# EAGLE design RC _RX (EAGLE 7.7.0)
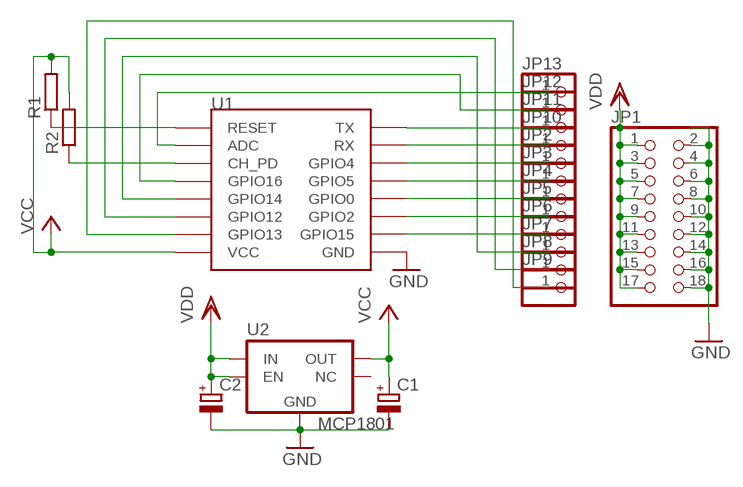
[diagram p0: schematic, sheet 1]

## Parts
C1  CPOL-EUA/3216-18W  [A/3216-18W]
C2  CPOL-EUA/3216-18W  [A/3216-18W]
JP1  PINHD-2X9  [2X09]
JP2  PINHD-1X1  [1X01]
JP3  PINHD-1X1  [1X01]
JP4  PINHD-1X1  [1X01]
JP5  PINHD-1X1  [1X01]
JP6  PINHD-1X1  [1X01]
JP7  PINHD-1X1  [1X01]
JP8  PINHD-1X1  [1X01]
JP9  PINHD-1X1  [1X01]
JP10  PINHD-1X1  [1X01]
JP11  PINHD-1X1  [1X01]
JP12  PINHD-1X1  [1X01]
JP13  PINHD-1X1  [1X01]
R1  R-EU_R0805  [R0805]
R2  R-EU_R0805  [R0805]
U1  ESP12  [ESP12]
U2  MCP1801  [SOT23-5]

## Nets
GND: C1.- C2.- JP1.2 JP1.4 JP1.6 JP1.8 JP1.10 JP1.12 JP1.14 JP1.16 JP1.18 U1.GND U2.2(GND)
N$1: R1.1 U1.RESET
N$2: JP11.1 U1.TX
N$3: JP2.1 U1.GPIO4
N$4: JP3.1 U1.GPIO5
N$5: JP4.1 U1.GPIO0
N$6: JP5.1 U1.GPIO2
N$7: JP6.1 U1.GPIO15
N$8: JP7.1 U1.GPIO14
N$9: JP8.1 U1.GPIO12
N$10: JP9.1 U1.GPIO13
N$11: JP10.1 U1.RX
N$12: R2.1 U1.CH_PD
N$13: JP12.1 U1.GPIO16
N$14: JP13.1 U1.ADC
VCC: C1.+ R1.2 R2.2 U1.VCC U2.5(OUT)
VDD: C2.+ JP1.1 JP1.3 JP1.5 JP1.7 JP1.9 JP1.11 JP1.13 JP1.15 JP1.17 U2.1(IN) U2.3(EN)
Unconnected: U2.4(NC)

## Library data of the parts
C1 C2 = rcl:CPOL-EU: POLARIZED CAPACITOR, European symbol
JP1 = pinhead:PINHD-2X9: PIN HEADER
JP2-JP13 = pinhead:PINHD-1X1: PIN HEADER
R1 R2 = rcl:R-EU_: RESISTOR, European symbol
U1 = esp8266modules:ESP12: ESP8266 Wifi module 12
U2 = bt_regulator:MCP1801: Microchip MCP1801 LDO Regulator The MCP1801 is a family of CMOS low dropout (LDO) voltage regulators that can deliver up to 150 mA of current while consuming only 25 μA of quiescent current (typical) with input operating range from 2.0V to 10.0V. Datasheet.pdf <http://ww1.microchip.com/downloads/en/DeviceDoc/22051D.pdf>

## Board
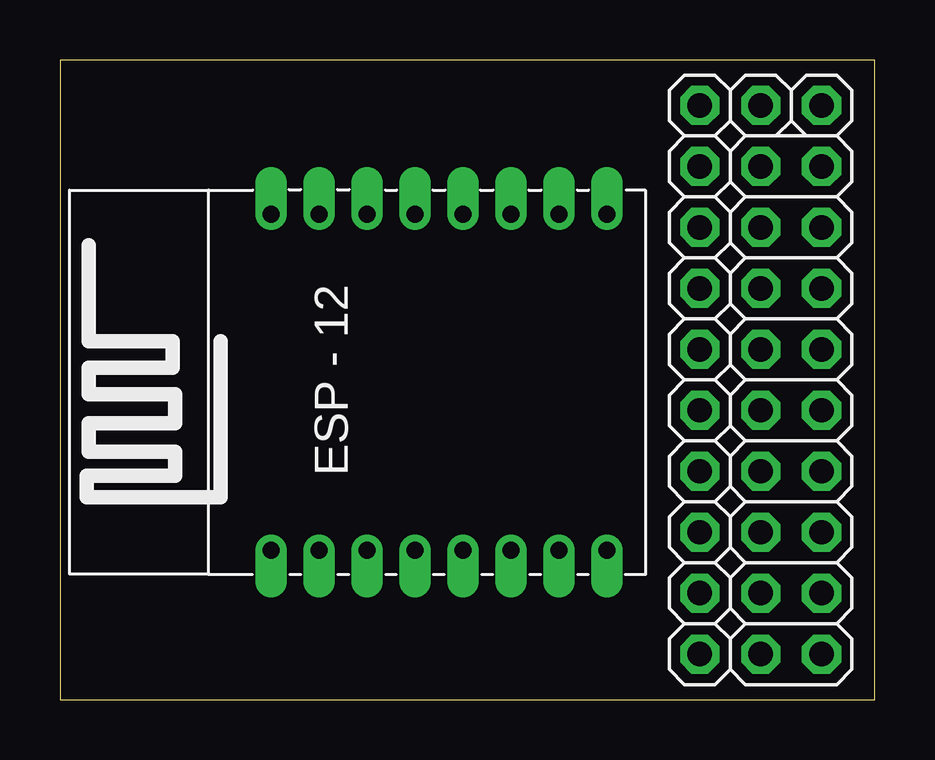
[diagram p1: board, top side]
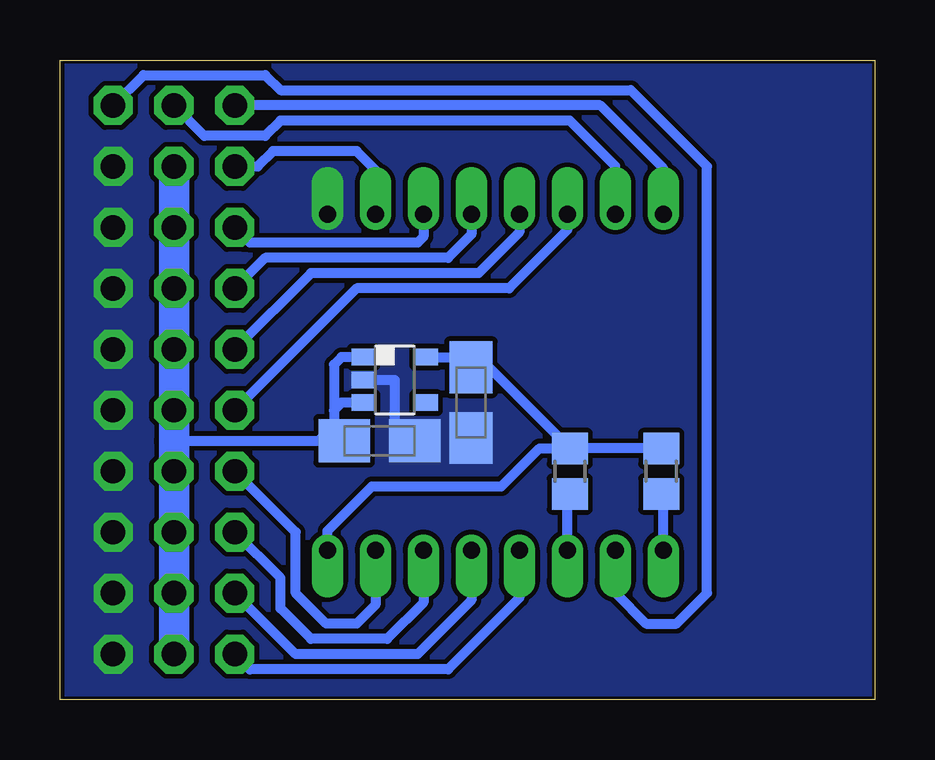
[diagram p2: board, bottom side, seen from below]

Size 33.96 x 26.66 mm. Coordinates in mm from the lower left corner, seen from the top.
Outline: 0,0 33.96,0 33.96,26.66 0,26.66 0,0
Copper layers (1*16): Top 0.035mm / dielectric 1.5mm / Bottom 0.035mm
Design rules "default *": minimum track width 12mil, minimum drill 24mil, track to track 8mil, track to pad 8mil, pad to pad 8mil, via to via 8mil, smd to smd 8mil, copper to edge 5mil, drill to drill 8mil, minimum pad ring 12mil, minimum via ring 12mil, stop-mask expansion 4mil, vias tented up to drill 0mil, thermal gap 10mil

### Footprints (pad centres in the part's own frame; a part is rotated, then mirrored left to right if it is on the bottom)
A/3216-18W = smd 2.15 x 1.8: + 1.475,0; - -1.475,0
2X09 = drill 1.016 octagon: 1 -10.16,-1.27; 2 -10.16,1.27; 3 -7.62,-1.27; 4 -7.62,1.27; 5 -5.08,-1.27; 6 -5.08,1.27; 7 -2.54,-1.27; 8 -2.54,1.27; 9 0,-1.27; 10 0,1.27; 11 2.54,-1.27; 12 2.54,1.27; 13 5.08,-1.27; 14 5.08,1.27; 15 7.62,-1.27; 16 7.62,1.27; 17 10.16,-1.27; 18 10.16,1.27
1X01 = drill 1.016 octagon: 1 0,0
R0805 = smd 1.3 x 1.5: 1 -0.95,0; 2 0.95,0
ESP12 = drill 0.7 offset: ADC -7.1,3.8; CH_PD -7.1,1.8; GND 6.9,-8.2; GPIO0 6.9,-2.2; GPIO2 6.9,-4.2; GPIO4 6.9,1.8; GPIO5 6.9,-0.2; GPIO12 -7.1,-4.2; GPIO13 -7.1,-6.2; GPIO14 -7.1,-2.2; GPIO15 6.9,-6.2; GPIO16 -7.1,-0.2; RESET -7.1,5.8; RX 6.9,3.8; TX 6.9,5.8; VCC -7.1,-8.2
SOT23-5 = smd 0.69 x 0.99: 1 -0.95,-1.3; 2 0,-1.3; 3 0.95,-1.3; 4 0.95,1.3; 5 -0.95,1.3

### Placement (x,y rotation side)
C1  16.83,12.38 90 bottom
C2  20.64,10.79 180 bottom
JP1  30.48,12.06 270 top
JP2  26.67,12.06 0 top
JP3  26.67,14.61 0 top
JP4  26.67,17.14 0 top
JP5  26.67,19.68 0 top
JP6  26.67,22.23 0 top
JP7  26.67,4.45 0 top
JP8  26.67,6.99 0 top
JP9  26.67,9.53 0 top
JP10  29.21,24.77 0 top
JP11  26.67,24.77 0 top
JP12  26.67,1.91 0 top
JP13  31.75,24.77 0 top
R1  8.89,9.53 90 bottom
R2  12.7,9.53 90 bottom
U1  14.61,13.34 90 top
U2  20,13.34 270 bottom

### Tracks (layer width: path | path; a pad name or v marks a point on that pad's centre or on a via)
GND
  Bottom 0.406: U2.2 20,13.34 20,11.63 C2.-
  pour Bottom (no thermals): 0,26.67 33.66,26.67 33.66,0 0,0
N$1
  Bottom 0.406: U1.RESET 8.8,8.49 R1.1
N$2
  Bottom 0.406: U1.TX 8.8,22.14 11.43,24.77 JP11.1
N$3
  Bottom 0.406: U1.GPIO4 12.8,19.58 15.24,17.14 21.59,17.14 JP2.1
N$4
  Bottom 0.406: U1.GPIO5 14.8,19.48 16.51,17.78 23.5,17.78 JP3.1
N$5
  Bottom 0.406: U1.GPIO0 16.8,19.39 17.78,18.41 25.4,18.41 JP4.1
N$6
  Bottom 0.406: U1.GPIO2 18.8,19.3 19.05,19.05 26.04,19.05 JP5.1
N$7
  Bottom 0.406: JP6.1 25.72,22.23 25.09,22.86 21.59,22.86 20.8,22.07 U1.GPIO15
N$8
  Bottom 0.406: U1.GPIO14 16.8,4.15 19.05,1.91 24.13,1.91 JP7.1
N$9
  Bottom 0.406: U1.GPIO12 18.8,4.05 20.32,2.54 23.5,2.54 24.77,3.81 24.77,5.08 JP8.1
N$10
  Bottom 0.406: U1.GPIO13 20.8,3.96 21.59,3.17 22.86,3.17 24.13,4.45 24.13,6.99 JP9.1
N$11
  Bottom 0.406: JP10.1 27.94,23.5 25.4,23.5 24.77,24.13 12.7,24.13 10.8,22.23 U1.RX
N$12
  Bottom 0.406: U1.CH_PD 12.8,8.47 R2.1
N$13
  Bottom 0.406: U1.GPIO16 14.8,4.25 17.78,1.27 26.04,1.27 JP12.1
N$14
  Bottom 0.406: U1.ADC 10.8,4.46 9.53,3.17 8.26,3.17 6.99,4.45 6.99,22.23 10.16,25.4 24.77,25.4 25.4,26.04 30.48,26.04 JP13.1
VCC
  Bottom 0.406: R1.2 R2.2 | U1.VCC 22.8,7.04 20.95,8.89 15.56,8.89 13.97,10.48 R2.2 | U2.5 17.25,14.29 C1.+ 16.08,13.86 R2.2
VDD
  Bottom 0.406: U2.1 22.23,14.29 22.54,13.97 22.54,12.06 | 22.54,12.06 22.54,11.43 | 22.54,11.43 22.54,11.22 C2.+ | U2.3 22.22,12.38 22.54,12.06 | 29.21,10.79 23.18,10.79 22.54,11.43
  Bottom 1.27: JP1.1 JP1.3 JP1.5 JP1.7 JP1.9 29.21,10.79 JP1.11 JP1.13 JP1.15 JP1.17